# Altium schematic sheet Rf reciever.SchDoc
size A
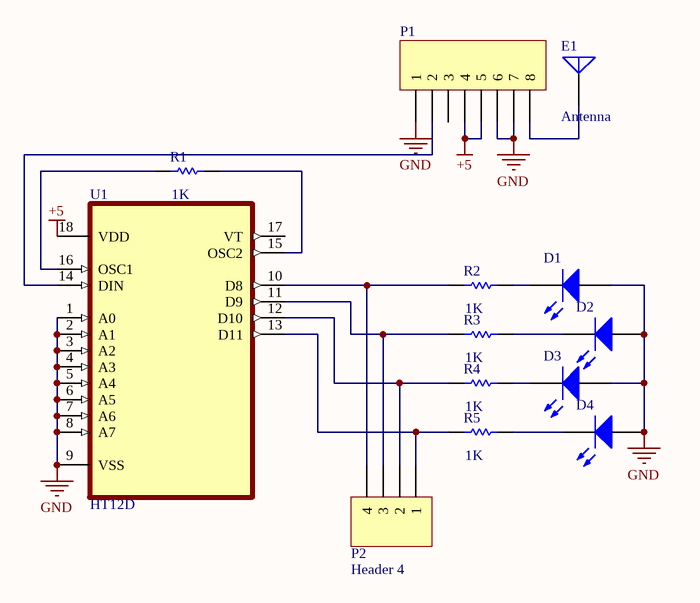
[diagram p0: Rf reciever.SchDoc]

## Parts
D1  LED0  [LED-0]  (value not drawn)
D2  LED0  [LED-0]  (value not drawn)
D3  LED0  [LED-0]  (value not drawn)
D4  LED0  [LED-0]  (value not drawn)
E1  Antenna  [PIN1]
P1  Header 8  [HDR1X8]  (value not drawn)
P2  Header 4  [HDR1X4]
R1  value 1K  [AXIAL-0.3]  (hidden comment: Res1)
R2  value 1K  [AXIAL-0.3]  (hidden comment: Res1)
R3  value 1K  [AXIAL-0.3]  (hidden comment: Res1)
R4  value 1K  [AXIAL-0.3]  (hidden comment: Res1)
R5  value 1K  [AXIAL-0.3]  (hidden comment: Res1)
U1  HT12D  [DIP254P762X342-18]

## Nets
+5: P1.4 P1.5 U1.18(VDD)
GND: D1.1(A) D2.1(A) D3.1(A) D4.1(A) P1.1 P1.6 P1.7 U1.1(A0) U1.2(A1) U1.3(A2) U1.4(A3) U1.5(A4) U1.6(A5) U1.7(A6) U1.8(A7) U1.9(VSS)
NetD1_2: D1.2(K) R2.2
NetD2_2: D2.2(K) R3.2
NetD3_2: D3.2(K) R4.2
NetD4_2: D4.2(K) R5.2
NetE1_1: E1.1(A) P1.8
NetP1_2: P1.2 U1.14(DIN)
NetP2_1: P2.1 R5.1 U1.13(D11)
NetP2_2: P2.2 R4.1 U1.12(D10)
NetP2_3: P2.3 R3.1 U1.11(D9)
NetP2_4: P2.4 R2.1 U1.10(D8)
NetR1_1: R1.1 U1.16(OSC1)
NetR1_2: R1.2 U1.15(OSC2)

Not connected (* = marked no-connect by the designer): P1 3; U1 17(VT)

## Library data of the parts
D1-D4 = LED0: Typical INFRARED GaAs LED; Published: 8-Jun-2000; LatestRevisionDate: 08-Jul-2005; LatestRevisionNote: Mech Layer 1 removed.; PackageReference: LED-0; Publisher: Altium Limited; PackageDescription: LED; 2 Leads
E1 = Antenna: Generic Antenna; Published: 24-Mar-1999; LatestRevisionDate: 17-Jul-2002; LatestRevisionNote: Re-released for DXP Platform.; PackageReference: PIN1; Publisher: Altium Limited
P1 = Header 8: Header, 8-Pin; LatestRevisionDate: 17-Jul-2002; LatestRevisionNote: Re-released for DXP Platform.; Publisher: Altium Limited
P2 = Header 4: Header, 4-Pin; LatestRevisionDate: 17-Jul-2002; LatestRevisionNote: Re-released for DXP Platform.; Publisher: Altium Limited
R1-R5 = Res1: Resistor; Published: 8-Jun-2000; LatestRevisionDate: 17-Jul-2002; LatestRevisionNote: Re-released for DXP Platform.; PackageReference: AXIAL-0.3; Publisher: Altium Limited; PackageDescription: Axial Device, Thru-Hole; 2 Leads; 0.3 in Pin Spacing
U1 = HT12D: MF: Holtek; Availability: Unavailable; SnapEDA_Link: https://www.snapeda.com/parts/HT12D/Holtek/view-part/53386/?ref=snap; MP: HT12D; Price: None; Package: DIP-18 Holtek; Value: *